# EasyEDA Pro project ProPrj_PomoDesk_V1.0.epro, schematic Schematic1

## Sheets
1 MAIN: Board Name: Board1; Create Date: 2025-03-01; Page Name: MAIN; Project Name: Pomodoro_desk; Schematic Name: Schematic1; Update Date: 2025-09-04; Company: EasyEDA.com; Page Size: A4; Version: V1.0
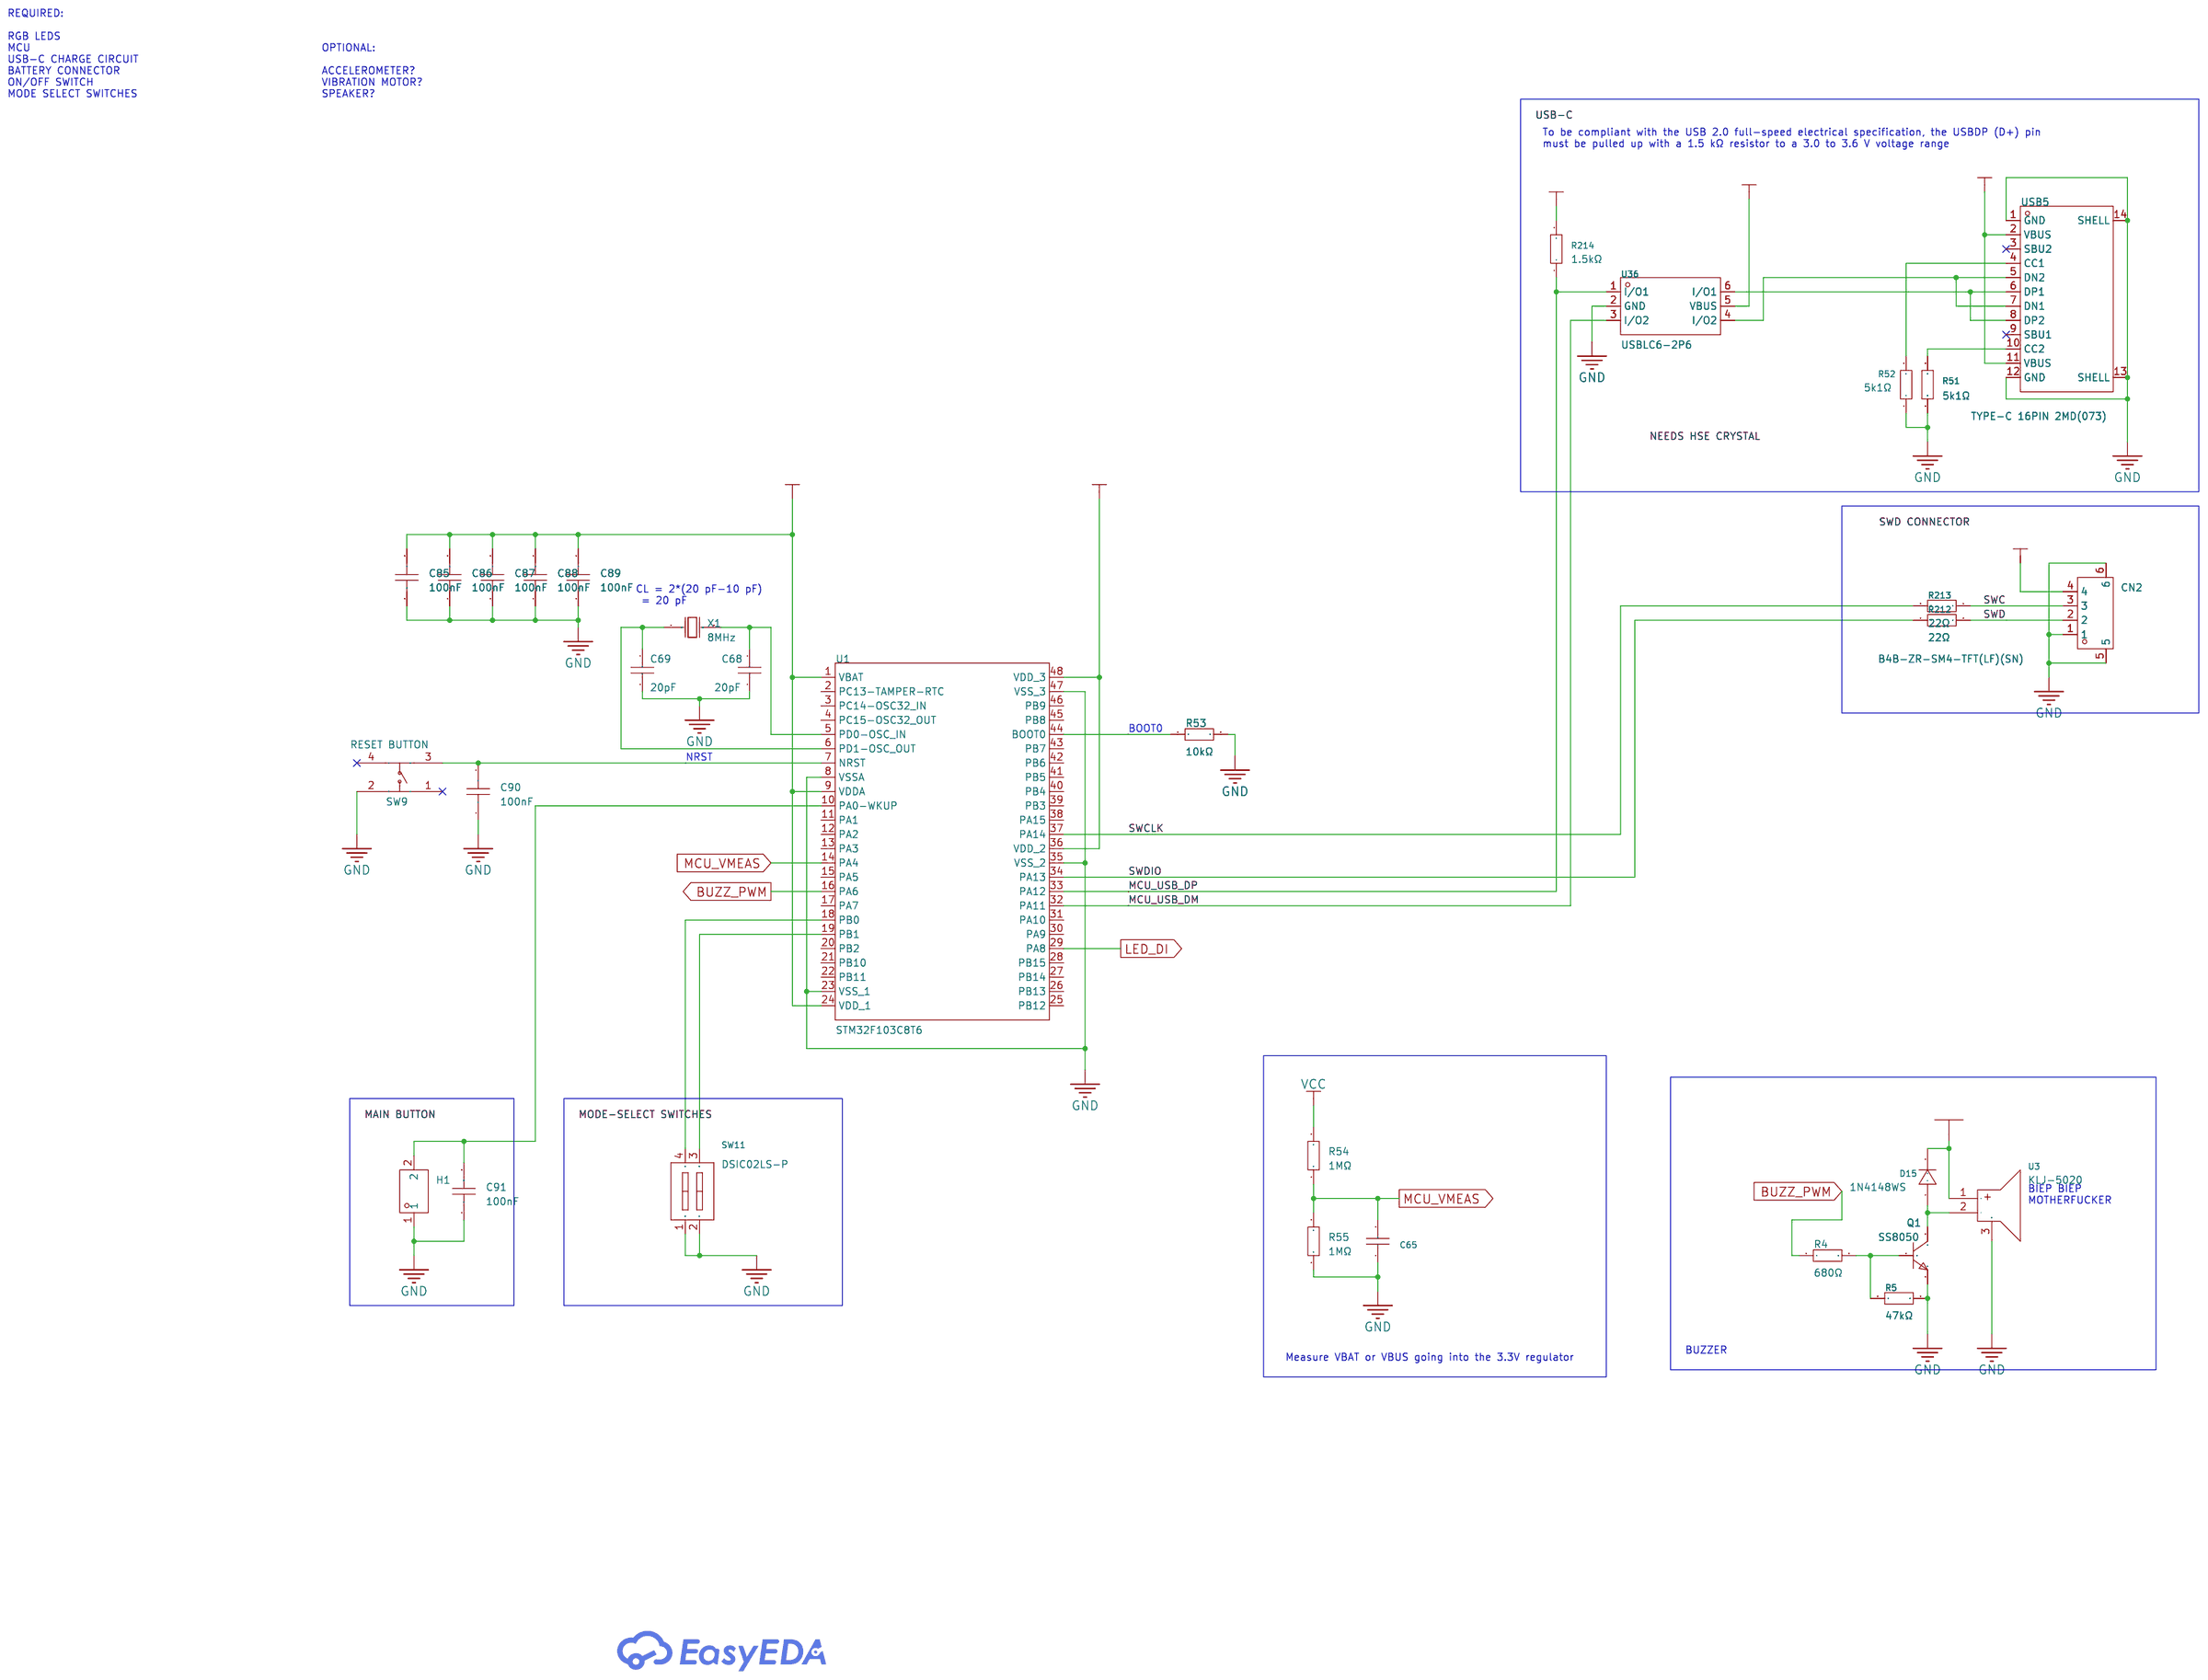
[diagram p0: MAIN]
2 LEDS: Create Date: 2025-08-28; Page Name: LEDS; Update Date: 2025-08-28
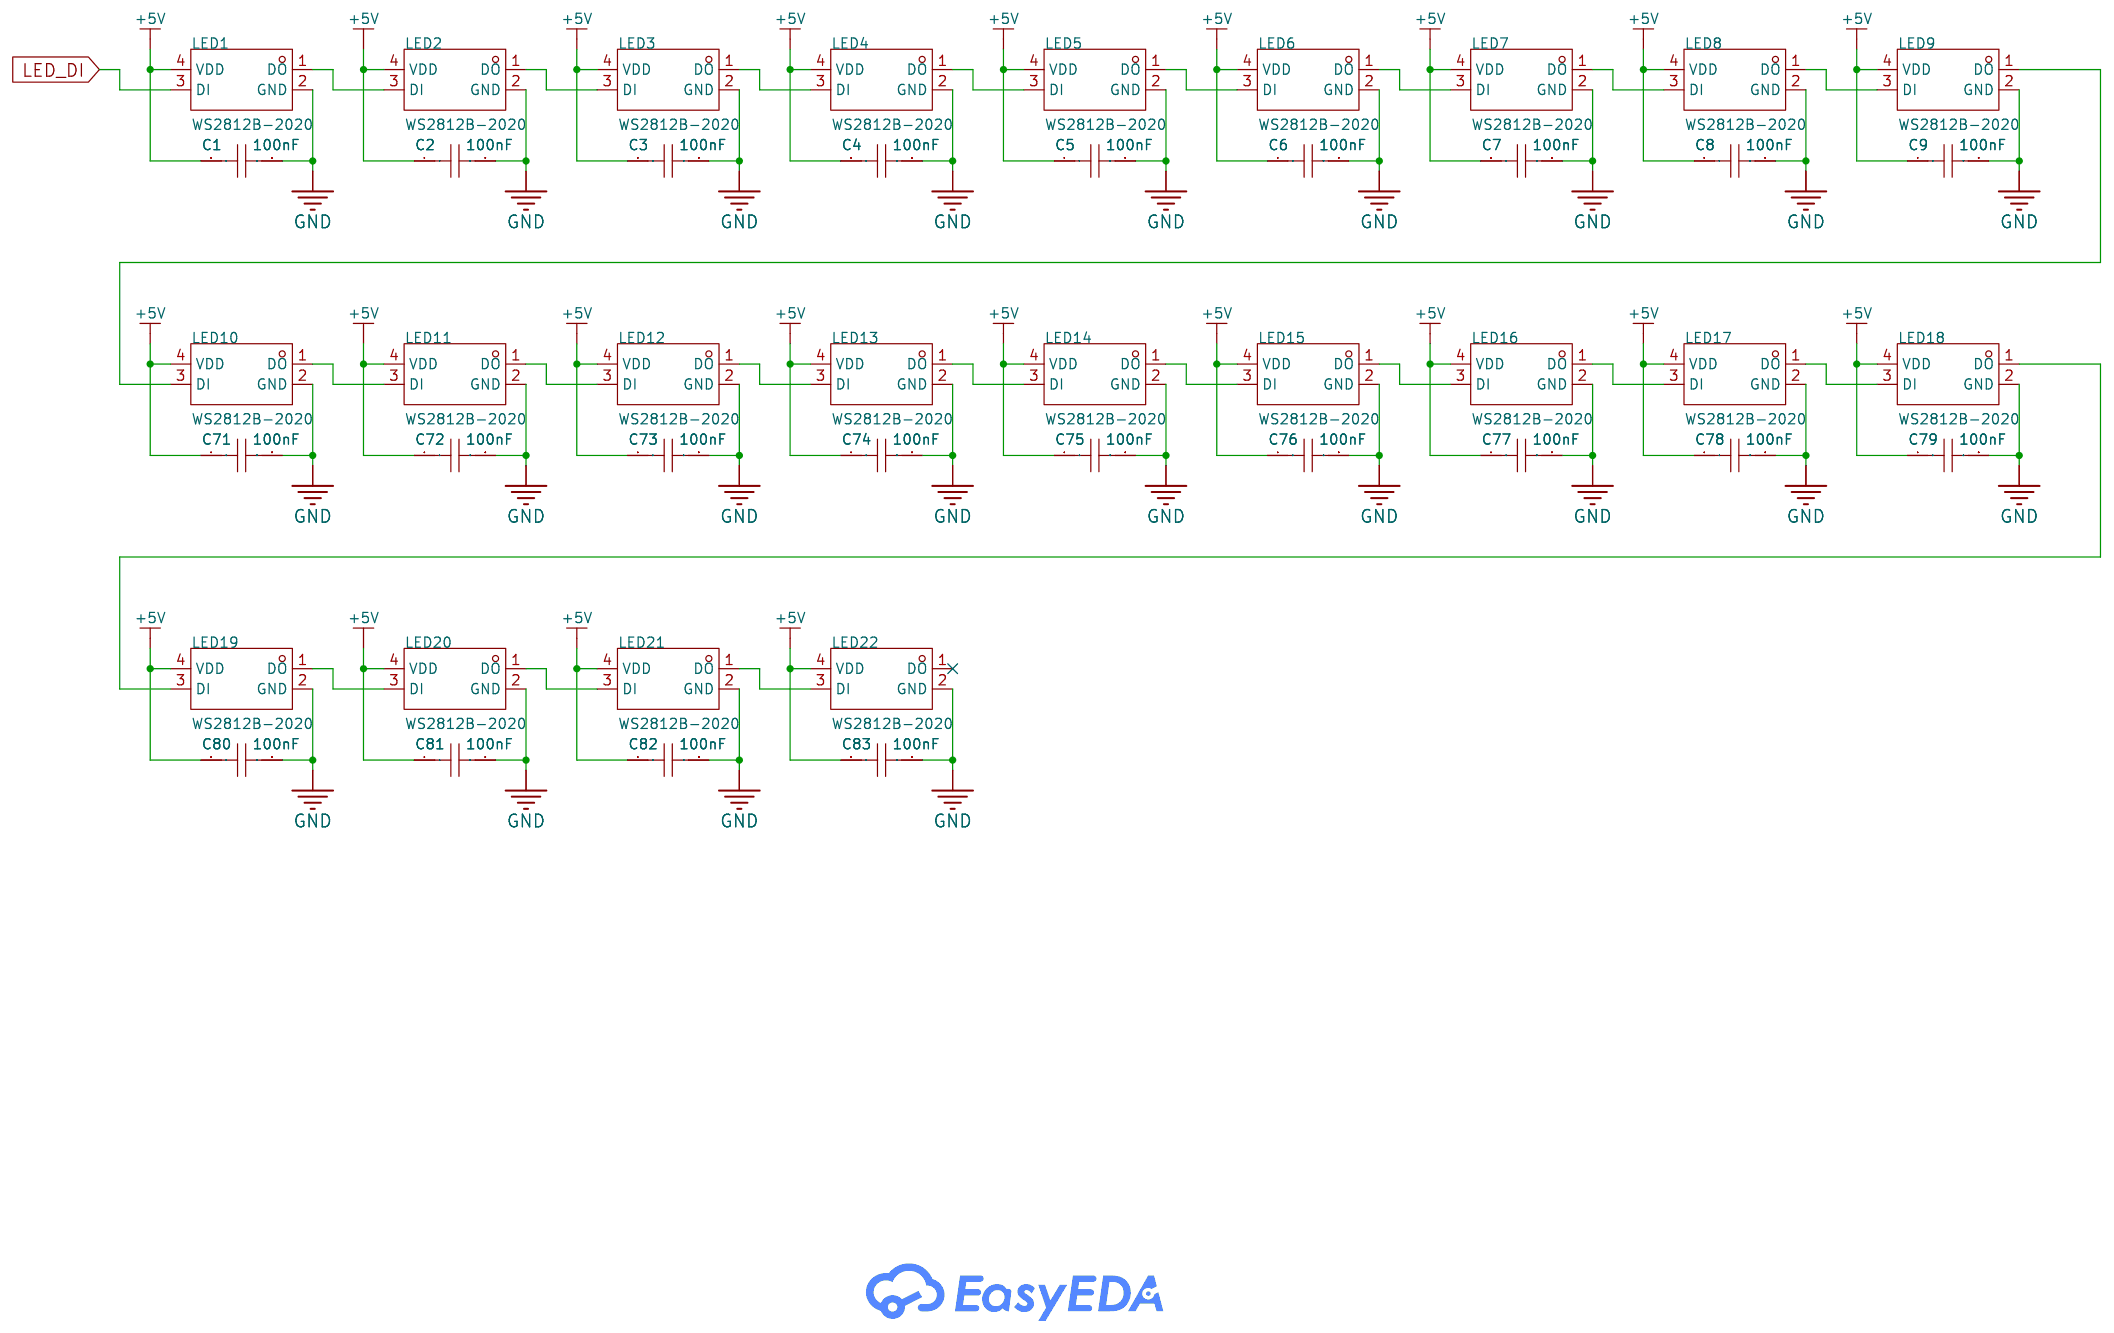
[diagram p1: LEDS]
3 POWER: Create Date: 2025-08-28; Page Name: POWER; Update Date: 2025-08-28
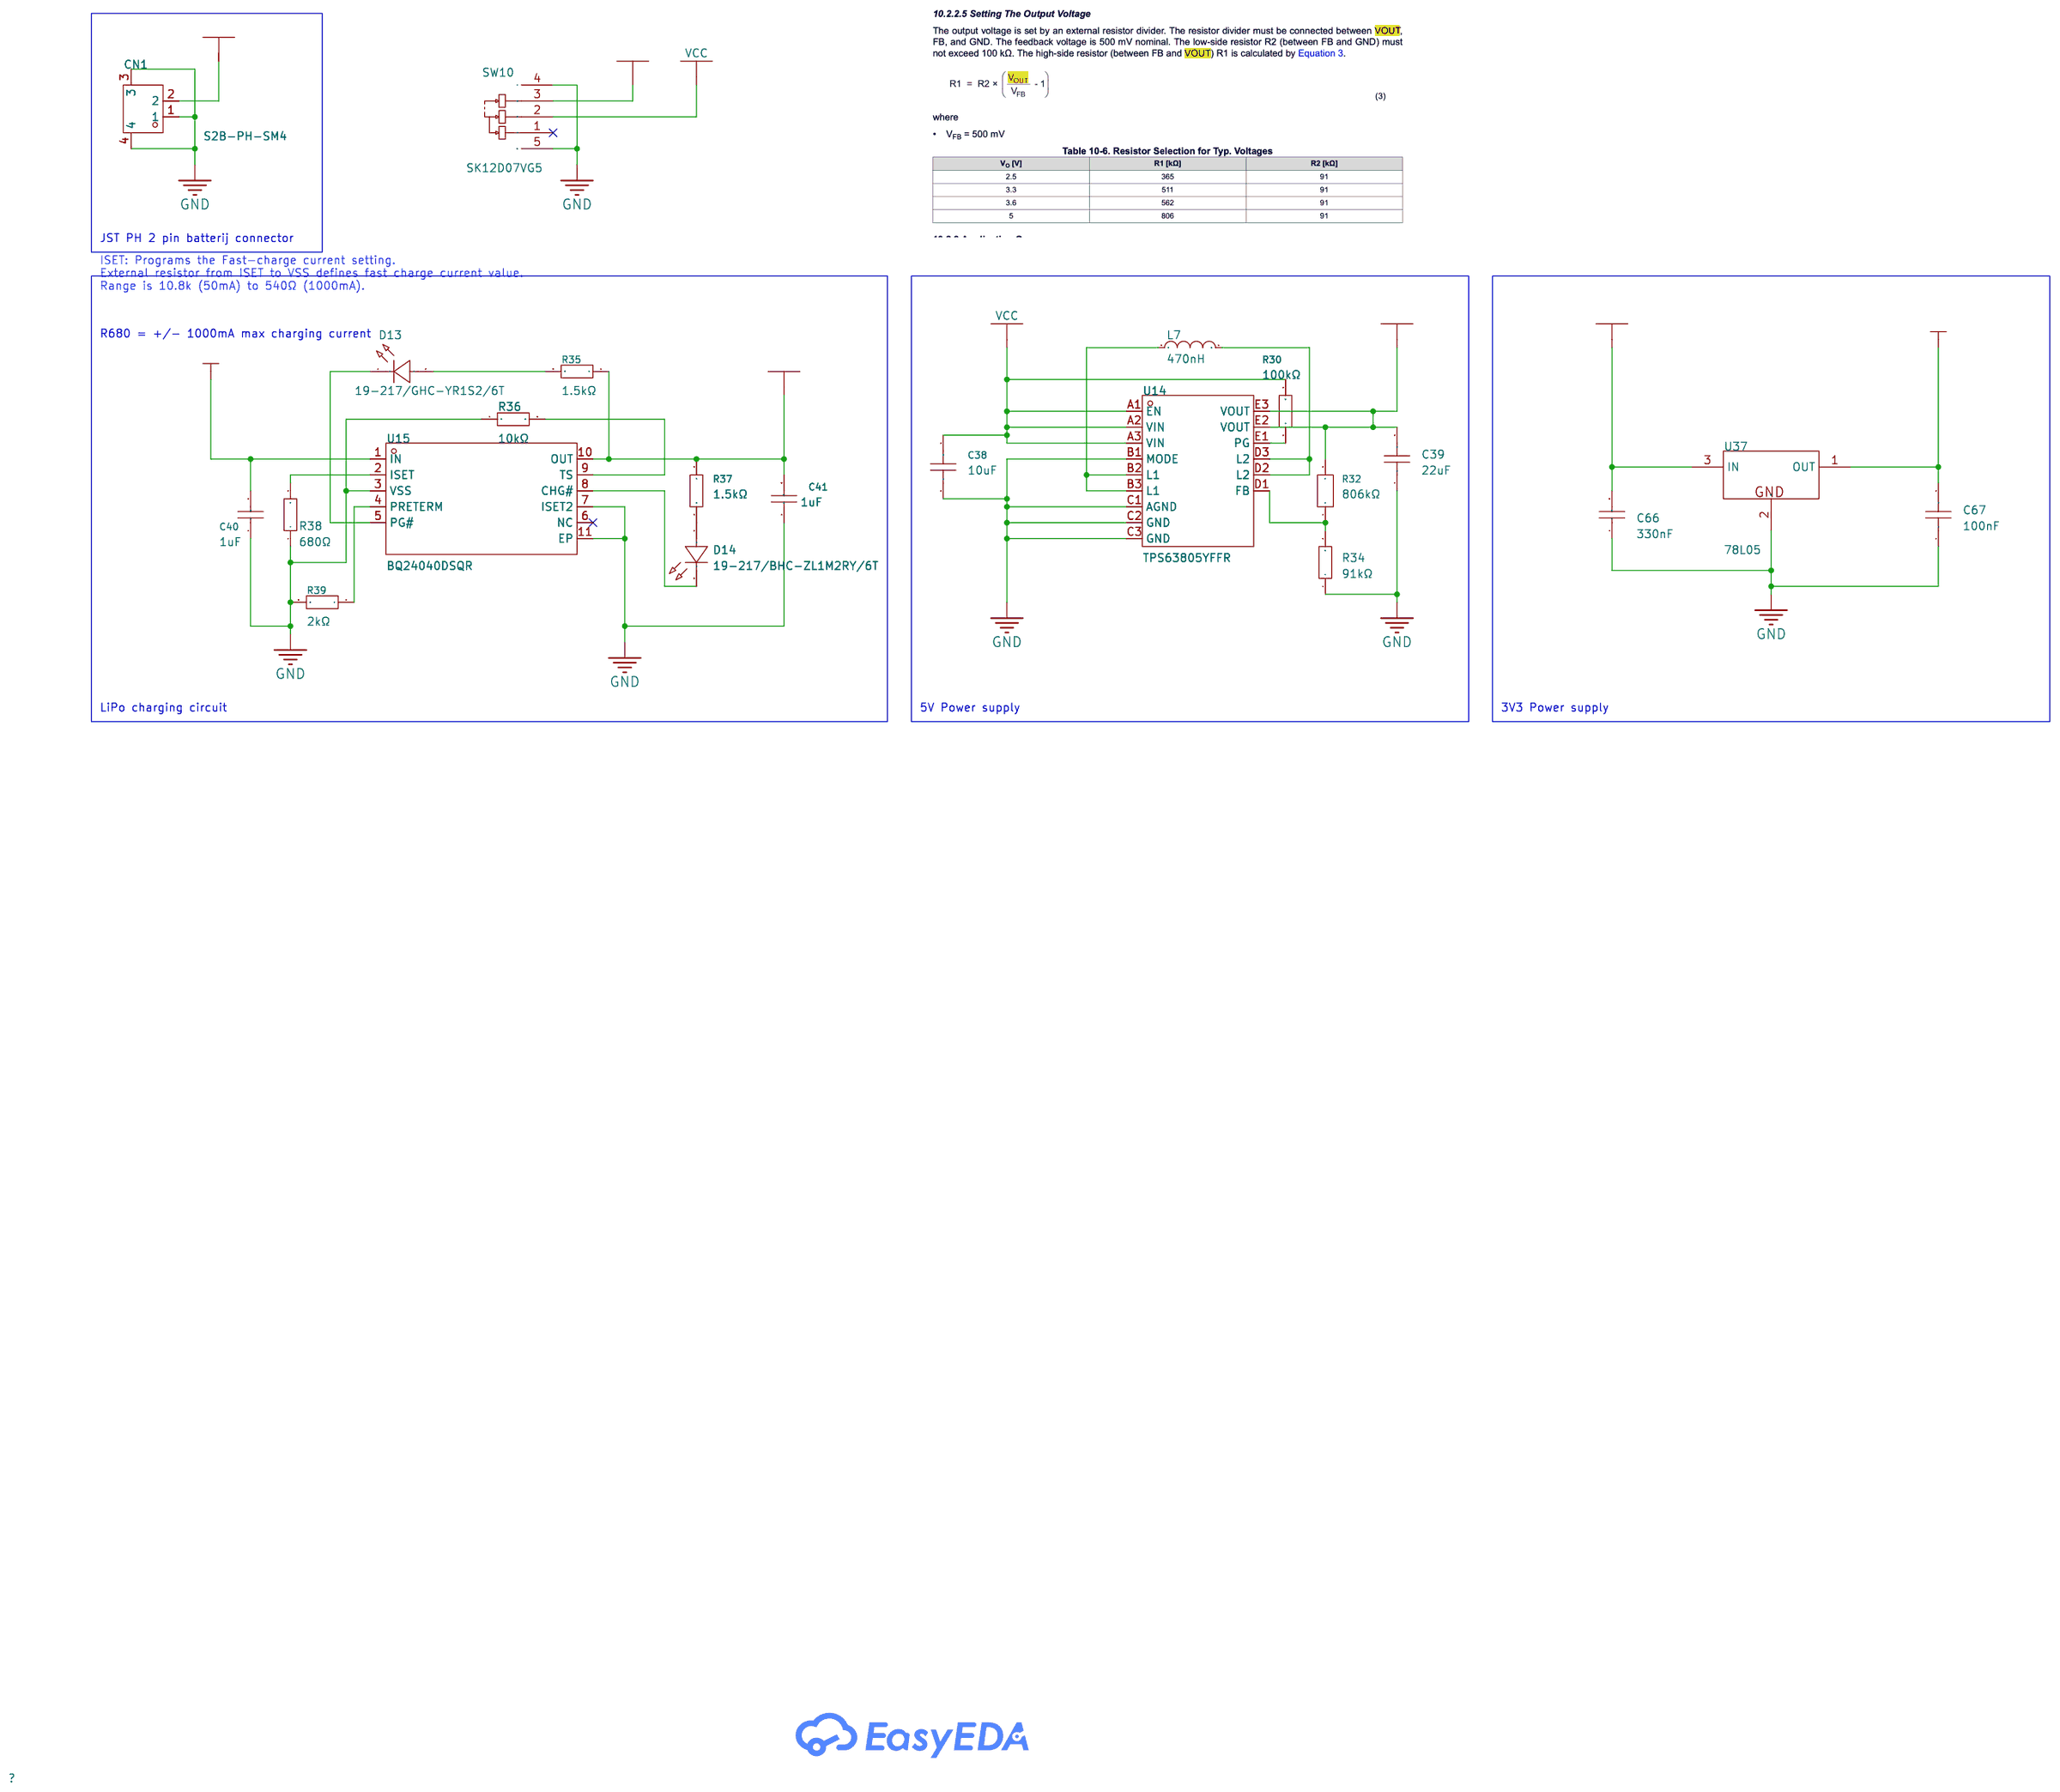
[diagram p2: POWER]

## Parts
sheet LEDS
C1  100nF  [C0402]
C2  100nF  [C0402]
C3  100nF  [C0402]
C4  100nF  [C0402]
C5  100nF  [C0402]
C6  100nF  [C0402]
C7  100nF  [C0402]
C8  100nF  [C0402]
C9  100nF  [C0402]
C71  100nF  [C0402]
C72  100nF  [C0402]
C73  100nF  [C0402]
C74  100nF  [C0402]
C75  100nF  [C0402]
C76  100nF  [C0402]
C77  100nF  [C0402]
C78  100nF  [C0402]
C79  100nF  [C0402]
C80  100nF  [C0402]
C81  100nF  [C0402]
C82  100nF  [C0402]
C83  100nF  [C0402]
LED1  WS2812B-2020  [LED-SMD_4P-L2.0-W2.0-TL_WS2812B-2020]
LED2  WS2812B-2020  [LED-SMD_4P-L2.0-W2.0-TL_WS2812B-2020]
LED3  WS2812B-2020  [LED-SMD_4P-L2.0-W2.0-TL_WS2812B-2020]
LED4  WS2812B-2020  [LED-SMD_4P-L2.0-W2.0-TL_WS2812B-2020]
LED5  WS2812B-2020  [LED-SMD_4P-L2.0-W2.0-TL_WS2812B-2020]
LED6  WS2812B-2020  [LED-SMD_4P-L2.0-W2.0-TL_WS2812B-2020]
LED7  WS2812B-2020  [LED-SMD_4P-L2.0-W2.0-TL_WS2812B-2020]
LED8  WS2812B-2020  [LED-SMD_4P-L2.0-W2.0-TL_WS2812B-2020]
LED9  WS2812B-2020  [LED-SMD_4P-L2.0-W2.0-TL_WS2812B-2020]
LED10  WS2812B-2020  [LED-SMD_4P-L2.0-W2.0-TL_WS2812B-2020]
LED11  WS2812B-2020  [LED-SMD_4P-L2.0-W2.0-TL_WS2812B-2020]
LED12  WS2812B-2020  [LED-SMD_4P-L2.0-W2.0-TL_WS2812B-2020]
LED13  WS2812B-2020  [LED-SMD_4P-L2.0-W2.0-TL_WS2812B-2020]
LED14  WS2812B-2020  [LED-SMD_4P-L2.0-W2.0-TL_WS2812B-2020]
LED15  WS2812B-2020  [LED-SMD_4P-L2.0-W2.0-TL_WS2812B-2020]
LED16  WS2812B-2020  [LED-SMD_4P-L2.0-W2.0-TL_WS2812B-2020]
LED17  WS2812B-2020  [LED-SMD_4P-L2.0-W2.0-TL_WS2812B-2020]
LED18  WS2812B-2020  [LED-SMD_4P-L2.0-W2.0-TL_WS2812B-2020]
LED19  WS2812B-2020  [LED-SMD_4P-L2.0-W2.0-TL_WS2812B-2020]
LED20  WS2812B-2020  [LED-SMD_4P-L2.0-W2.0-TL_WS2812B-2020]
LED21  WS2812B-2020  [LED-SMD_4P-L2.0-W2.0-TL_WS2812B-2020]
LED22  WS2812B-2020  [LED-SMD_4P-L2.0-W2.0-TL_WS2812B-2020]
sheet MAIN
C65  10nF  [C0402]
C68  20pF  [C0402]
C69  20pF  [C0402]
C85  100nF  [C0402]
C86  100nF  [C0402]
C87  100nF  [C0402]
C88  100nF  [C0402]
C89  100nF  [C0402]
C90  100nF  [C0402]
C91  100nF  [C0402]
CN2  B4B-ZR-SM4-TFT(LF)(SN)  [CONN-TH_B4B-ZR-SM4-TFT-LF-SN]
D15  1N4148WS  [SOD-323_L1.8-W1.3-LS2.5-RD]
H1  -  [HDR-TH_2P-P2.54-V-M-2]  (no BOM)
Q1  SS8050  [SOT-23-3_L2.9-W1.3-P1.90-LS2.4-BR]
R4  680Ω  [R0402]
R5  47kΩ  [R0402]
R51  5k1Ω  [R0402]
R52  5k1Ω  [R0402]
R53  10kΩ  [R0402]
R54  1MΩ  [R0402]
R55  1MΩ  [R0402]
R212  22Ω  [R0402]
R213  22Ω  [R0402]
R214  1.5kΩ  [R0402]
SW9  RESET BUTTON  [SW-SMD_4P-L4.2-W3.2-P2.15-LS4.5]
SW11  DSIC02LS-P  [SW-SMD_4P-L5.1-W6.1-P2.54-LS9.8]
U1  STM32F103C8T6  [LQFP-48_L7.0-W7.0-P0.50-LS9.0-BL]
U3  KLJ-5020  [BUZ-SMD_4P-L5.0-W5.0-P3.80-TL]
U36  USBLC6-2P6  [SOT-666-6_L1.6-W1.2-P0.50-LS1.6-BL]
USB5  TYPE-C 16PIN 2MD(073)  [USB-C-SMD_TYPE-C-6PIN-2MD-073]
X1  8MHz  [CRYSTAL-SMD_L5.0-W3.2]
sheet POWER
C38  10uF  [C0603]
C39  22uF  [C0603]
C40  1uF  [C0805]
C41  1uF  [C0805]
C66  330nF  [C0603]
C67  100nF  [C0402]
CN1  S2B-PH-SM4  [CONN-SMD_P2.00_S2B-PH-SM4-TB-LF-SN]
D13  19-217/GHC-YR1S2/6T  [LED0603-RD_GREEN]
D14  19-217/BHC-ZL1M2RY/6T  [LED0603-R-RD_BLUE-A]
L7  470nH  [L1008]
R30  100kΩ  [R0402]
R32  806kΩ  [R0402]
R34  91kΩ  [R0402]
R35  1.5kΩ  [R0402]
R36  10kΩ  [R0402]
R37  1.5kΩ  [R0402]
R38  680Ω  [R0402]
R39  2kΩ  [R0402]
SW10  SK12D07VG5  [SW-TH_SK12D07VG5-1]
U14  TPS63805YFFR  [DSBGA-15_L2.3-W1.3-R5-C3-P0.40-TL]
U15  BQ24040DSQR  [WSON-10_L2.0-W2.0-P0.40-BL-EP]
U37  78L05  [SOT-89-3_L4.5-W2.5-P1.50-LS4.2-BR]

## Library data of the parts
C1-C9 C67 C71-C83 C85-C91 = CL05B104KO5NNNC: Capacitance:100nF Tolerance:±10% Tolerance:±10% Voltage Rating:16V Temperature Coefficient:X7R; LCSC Part Name: 100nF ±10% 16V; Supplier Part: C1525; Manufacturer: SAMSUNG(三星); Supplier Footprint: 0402; JLCPCB Part Class: Basic Part; Datasheet: https://item.szlcsc.com/datasheet/CL05B104KO5NNNC/1877.html; Supplier: LCSC; Tolerance: ±10%; Voltage Rating: 16V; Temperature Coefficient: X7R
LED1-LED22 = WS2812B-2020: Wavelength:515.6nm；622.5nm；470.4nm Luminous Intensity:200mcd；160mcd；520mcd Fixed-Frequency Pwm Mode:- Data Transmission Rate:100KB/S Voltage - Supply:5V Voltage - Supply:5V Quiescent Current:- Lens Color:- ESD Withstand Voltage:- Installation method:op Vi; LCSC Part Name: RGB三色; Supplier Part: C965555; Manufacturer: worldsemi; Supplier Footprint: SMD,2.2x2mm; JLCPCB Part Class: Extended Part; Datasheet: https://item.szlcsc.com/datasheet/WS2812B-2020/1051115.html; Supplier: LCSC; Wavelength: 515.6nm；622.5nm；470.4nm; Luminous Intensity: 200mcd；160mcd；520mcd; Data Transmission Rate: 100KB/S; Voltage - Supply: 5V; Installation method: op View Mount
C65 = CL05B103KB5NNNC: Capacitance: Tolerance:±10% Tolerance:±10% Voltage Rated: Temperature Coefficient:; LCSC Part Name: 10nF ±10% 50V; Supplier Part: C15195; Manufacturer: SAMSUNG(三星); Supplier Footprint: 0402; JLCPCB Part Class: Basic Part; Datasheet: https://atta.szlcsc.com/upload/public/pdf/source/20160218/1457707763339.pdf; Supplier: LCSC; Tolerance: ±10%
C68 C69 = 0402CG200J500NT: Capacitance:20pF Tolerance:±5% Tolerance:±5% Voltage Rating:50V Temperature Coefficient:C0G; LCSC Part Name: 20pF ±5% 50V; Supplier Part: C1554; Manufacturer: FH(风华); Supplier Footprint: 0402; JLCPCB Part Class: Basic Part; Datasheet: https://item.szlcsc.com/datasheet/0402CG200J500NT/1906.html; Supplier: LCSC; Tolerance: ±5%; Voltage Rating: 50V; Temperature Coefficient: C0G
CN2 = B4B-ZR-SM4-TFT(LF)(SN): Pins Structure:1x4P Pitch:1.5mm Mounting Type:Surface Mount,Vertical Reference Series:ZH Number of Pins:4P Number of Rows:1 Number of PINs Per Row:4 Row Spacing:- Current Rating:1A Contact Material:Brass Contact Plating:Tin Operating Temperature:-25℃~+85℃; LCSC Part Name: 1x4P 间距:1.5mm 立贴 系列:ZH; Supplier Part: C495544; Manufacturer: JST; Supplier Footprint: SMD,P=1.5mm; JLCPCB Part Class: Extended Part; Datasheet: https://item.szlcsc.com/datasheet/B4B-ZR-SM4-TFT(LF)(SN)/506553.html; Supplier: LCSC; Pins Structure: 1x4P; Pitch: 1.5mm; Mounting Type: Surface Mount,Vertical; Reference Series: ZH; Number of Pins: 4P; Number of Rows: 1; Number of PINs Per Row: 4; Current Rating: 1A; Contact Material: Brass; Contact Plating: Tin; Operating Temperature: -25℃~+85℃; Voltage Rating: 50V; Plastic Material: PA6T; Flame Retardant Rating: UL94V-0; Supplementary Features: Auxiliary Solder Pin; Color: White; Z-Height of the Board: 5mm; X-Length of Bottom Edge on Board (Spacing Line): 9mm; Y-Width of Bottom Edge on Board: 5.2mm
D15 = 1N4148WS_C2128: Diode Configuration: Forward Voltage (Vf@If):1.25V@150mA Reverse Voltage (Vr): Average Rectified Current (Io): Power Dissipation: Reverse Leakage Current:1uA@75V Reverse Recovery Time (trr): Operating Temperature:- Operating Temperature:-; LCSC Part Name: 电压:100V 电流:150mA; Supplier Part: C2128; Manufacturer: CJ(江苏长电/长晶); Supplier Footprint: SOD-323; JLCPCB Part Class: Basic Part; Datasheet: https://atta.szlcsc.com/upload/public/pdf/source/20140809/1457707208178.pdf; Supplier: LCSC; Forward Voltage (Vf@If): 1.25V@150mA; Reverse Leakage Current: 1uA@75V
H1 = HDR-M_2.54_2x1: Supplier Footprint: Through
Q1 = SS8050_C2150: Transistor Type: Collector Current (Ic): Collector-Emitter Breakdown Voltage (Vceo): Power Dissipation (Pd): DC Current Gain (hFE@Ic,Vce):200@100mA,1V DC Current Gain (hFE@Ic,Vce):200@100mA,1V Transition Frequency (fT):100MHz Collector Cut-Off Current (Ic; LCSC Part Name: SS8050(RANGE:200-350) hfe=200~350; Supplier Part: C2150; Manufacturer: CJ(江苏长电/长晶); Supplier Footprint: SOT-23; JLCPCB Part Class: Basic Part; Datasheet: https://atta.szlcsc.com/upload/public/pdf/source/20230322/AEE86F4B043774EFF80CAEA14A37D9E9.pdf; Supplier: LCSC; DC Current Gain (hFE@Ic,Vce): 200@100mA,1V; Transition Frequency (fT): 100MHz; Collector Cut-Off Current (Icbo): 100nA; Collector-Emitter Saturation Voltage (VCE(sat)@Ic,Ib): 500mV@800mA,80mA
R4 R38 = 0402WGF6800TCE: Type:Thick Film Resistors Resistance: Tolerance:±1% Tolerance:±1% Power(Watts): Overload Voltage (Max): Temperature Coefficient:±100ppm/℃ Temperature Coefficient:±100ppm/℃ Operating Temperature Range:-55℃~+155℃ Operating Temperature Range:-55℃~+155℃; LCSC Part Name: 680Ω ±1% 62.5mW 厚膜电阻; Supplier Part: C25130; Manufacturer: UNI-ROYAL(厚声); Supplier Footprint: 0402; JLCPCB Part Class: Extended Part; Datasheet: https://atta.szlcsc.com/upload/public/pdf/source/20200306/C422600_1E6D84923E4A46A82E41ADD87F860B5C.pdf; Supplier: LCSC; Type: Thick Film Resistors; Tolerance: ±1%; Temperature Coefficient: ±100ppm/℃; Operating Temperature Range: -55℃~+155℃
R5 = 0402WGF4702TCE: Type:Thick Film Resistors Resistance:47kΩ Tolerance:±1% Tolerance:±1% Power(Watts): Overload Voltage (Max): Temperature Coefficient:±100ppm/℃ Temperature Coefficient:±100ppm/℃ Operating Temperature Range:-55℃~+155℃ Operating Temperature Range:-55℃~+155℃; LCSC Part Name: 47kΩ ±1% 62.5mW 厚膜电阻; Supplier Part: C25792; Manufacturer: UNI-ROYAL(厚声); Supplier Footprint: 0402; JLCPCB Part Class: Basic Part; Datasheet: https://atta.szlcsc.com/upload/public/pdf/source/20200306/C422600_1E6D84923E4A46A82E41ADD87F860B5C.pdf; Supplier: LCSC; Type: Thick Film Resistors; Tolerance: ±1%; Temperature Coefficient: ±100ppm/℃; Operating Temperature Range: -55℃~+155℃
R51 R52 = 0402WGF5101TCE: Type:Thick Film Resistors Resistance:5.1kΩ Tolerance:±1% Tolerance:±1% Power(Watts): Overload Voltage (Max): Temperature Coefficient:±100ppm/℃ Temperature Coefficient:±100ppm/℃ Operating Temperature Range:-55℃~+155℃ Operating Temperature Range:-55℃~+155℃; LCSC Part Name: 5.1kΩ ±1% 62.5mW 厚膜电阻; Supplier Part: C25905; Manufacturer: UNI-ROYAL(厚声); Supplier Footprint: 0402; JLCPCB Part Class: Basic Part; Datasheet: https://atta.szlcsc.com/upload/public/pdf/source/20200306/C422600_1E6D84923E4A46A82E41ADD87F860B5C.pdf; Supplier: LCSC; Type: Thick Film Resistors; Tolerance: ±1%; Temperature Coefficient: ±100ppm/℃; Operating Temperature Range: -55℃~+155℃
R36 R53 = 0402WGF1002TCE: Type:Thick Film Resistors Resistance:10kΩ Tolerance:±1% Tolerance:±1% Power(Watts): Overload Voltage (Max): Temperature Coefficient:±100ppm/℃ Temperature Coefficient:±100ppm/℃ Operating Temperature Range:-55℃~+155℃ Operating Temperature Range:-55℃~+155℃; LCSC Part Name: 10kΩ ±1% 62.5mW 厚膜电阻; Supplier Part: C25744; Manufacturer: UNI-ROYAL(厚声); Supplier Footprint: 0402; JLCPCB Part Class: Basic Part; Datasheet: https://atta.szlcsc.com/upload/public/pdf/source/20200306/C422600_1E6D84923E4A46A82E41ADD87F860B5C.pdf; Supplier: LCSC; Type: Thick Film Resistors; Tolerance: ±1%; Temperature Coefficient: ±100ppm/℃; Operating Temperature Range: -55℃~+155℃
R54 R55 = 0402WGF1004TCE: Type:Thick Film Resistors Resistance:1MΩ Tolerance:±1% Tolerance:±1% Power(Watts): Overload Voltage (Max): Temperature Coefficient:±100ppm/℃ Temperature Coefficient:±100ppm/℃ Operating Temperature Range:-55℃~+155℃ Operating Temperature Range:-55℃~+155℃; LCSC Part Name: 1MΩ ±1% 62.5mW 厚膜电阻; Supplier Part: C26083; Manufacturer: UNI-ROYAL(厚声); Supplier Footprint: 0402; JLCPCB Part Class: Basic Part; Datasheet: https://atta.szlcsc.com/upload/public/pdf/source/20200306/C422600_1E6D84923E4A46A82E41ADD87F860B5C.pdf; Supplier: LCSC; Type: Thick Film Resistors; Tolerance: ±1%; Temperature Coefficient: ±100ppm/℃; Operating Temperature Range: -55℃~+155℃
R212 R213 = 0402WGF220JTCE: Type:Thick Film Resistors Resistance:22Ω Tolerance:±1% Tolerance:±1% Power(Watts): Overload Voltage (Max): Temperature Coefficient:±100ppm/℃ Temperature Coefficient:±100ppm/℃ Operating Temperature Range:-55℃~+155℃ Operating Temperature Range:-55℃~+155℃; LCSC Part Name: 22Ω ±1% 62.5mW 厚膜电阻; Supplier Part: C25092; Manufacturer: UNI-ROYAL(厚声); Supplier Footprint: 0402; JLCPCB Part Class: Basic Part; Datasheet: https://atta.szlcsc.com/upload/public/pdf/source/20200306/C422600_1E6D84923E4A46A82E41ADD87F860B5C.pdf; Supplier: LCSC; Type: Thick Film Resistors; Tolerance: ±1%; Temperature Coefficient: ±100ppm/℃; Operating Temperature Range: -55℃~+155℃
R35 R37 R214 = 0402WGF1501TCE: Type:Thick Film Resistors Resistance:1.5kΩ Tolerance:±1% Tolerance:±1% Power(Watts): Overload Voltage (Max): Temperature Coefficient:±100ppm/℃ Temperature Coefficient:±100ppm/℃ Operating Temperature Range:-55℃~+155℃ Operating Temperature Range:-55℃~+155℃; LCSC Part Name: 1.5kΩ ±1% 62.5mW 厚膜电阻; Supplier Part: C25867; Manufacturer: UNI-ROYAL(厚声); Supplier Footprint: 0402; JLCPCB Part Class: Basic Part; Datasheet: https://atta.szlcsc.com/upload/public/pdf/source/20200306/C422600_1E6D84923E4A46A82E41ADD87F860B5C.pdf; Supplier: LCSC; Type: Thick Film Resistors; Tolerance: ±1%; Temperature Coefficient: ±100ppm/℃; Operating Temperature Range: -55℃~+155℃
SW9 = GT-TC048D-H025-L1: Circuit:SPST Actuator Style:Oval button Operating Force:400gf Mounting Style:Brick nogging Switch Length:4.2mm Switch Width:3.2mm Switch Height:2.5mm Strike Gundam:不带 Contact Current:50mA Voltage Rating (DC):12V Insulation Resistance:100MΩ Actuator/Cap Co; LCSC Part Name: 4.2*3.2*2.5mm 立贴 轻触开关; Supplier Part: C843674; Manufacturer: G-Switch(品赞); Supplier Footprint: SMD; JLCPCB Part Class: Extended Part; Datasheet: https://atta.szlcsc.com/upload/public/pdf/source/20201110/C843674_6F8C4412097F3852FA32BC425FAAA2F5.pdf; Supplier: LCSC; Circuit: SPST; Actuator Style: Oval button; Operating Force: 400gf; Mounting Style: Brick nogging; Switch Length: 4.2mm; Switch Width: 3.2mm; Switch Height: 2.5mm; Strike Gundam: 不带; Contact Current: 50mA; Voltage Rating (DC): 12V; Insulation Resistance: 100MΩ; Actuator/Cap Color: Black; With Lamp: No; Pin Style: J pin; Mechanical Life: 10万次; Operating Temperature: -30℃~+85℃
SW11 = DSIC02LS-P_C489174: Type:平拨,凸起式 Circuit:SPST Number of Positions:2Bit Pin Style:Gull Wing Lead Pitch:2.54mm Current Rating:25mA Voltage Rating:24V Operating Temperature:-20℃~+70℃ Operating Temperature:-20℃~+70℃ Operating Life:3千次 Color:Black; LCSC Part Name: 间距2.54mm 平拨,凸起式 2位拨码开关; Supplier Part: C489174; Manufacturer: XKB Connectivity(中国星坤); Supplier Footprint: SMD-4P,5.1x6.1mm; JLCPCB Part Class: Extended Part; Datasheet: https://atta.szlcsc.com/upload/public/pdf/source/20200227/C424380_7B5FE7C891E0521A8B96890FFC9096F0.pdf; Supplier: LCSC; Type: 平拨,凸起式; Circuit: SPST; Number of Positions: 2Bit; Pin Style: Gull Wing; Lead Pitch: 2.54mm; Current Rating: 25mA; Voltage Rating: 24V; Operating Temperature: -20℃~+70℃; Operating Life: 3千次; Color: Black
U1 = STM32F103C8T6: CPU Core:ARM-M3 CPU Maximum Speed:72MHz Program Storage Size:64KB Program Memory Type:FLASH Number of I/O:37 ADC (Bit):12bit Voltage - Supply:2V~3.6V Voltage - Supply:2V~3.6V Applications:-; LCSC Part Name: 主流增强型ARM Cortex-M3 MCU，具有64 KB Flash、72 MHz CPU、电机控制、USB和CAN; Supplier Part: C8734; Manufacturer: ST(意法半导体); Supplier Footprint: LQFP-48(7x7); JLCPCB Part Class: Extended Part; Datasheet: https://item.szlcsc.com/datasheet/STM32F103C8T6/9243.html; Supplier: LCSC; CPU Core: ARM-M3; CPU Maximum Speed: 72MHz; Program Storage Size: 64KB; Program Memory Type: FLASH; Number of I/O: 37; ADC (Bit): 12bit; Voltage - Supply: 2V~3.6V
U3 = KLJ-5020: LCSC Part Name: 贴片蜂鸣器; Supplier Part: C556937; Manufacturer: KELIKING(凯丽金); Supplier Footprint: SMD,5x5mm; JLCPCB Part Class: Extended Part; Datasheet: https://atta.szlcsc.com/upload/public/pdf/source/20200519/C556937_434224E60D77FB2EA05BB02010B3CD4E.pdf; Supplier: LCSC
U36 = USBLC6-2P6: Type:ESD; LCSC Part Name: MSL=3; Supplier Part: C2827693; Manufacturer: TECH PUBLIC(台舟); Supplier Footprint: SOT-666-6; JLCPCB Part Class: Extended Part; Datasheet: https://atta.szlcsc.com/upload/public/pdf/source/20210810/36353A9194EA9F4E33F8AE18BE051AEA.pdf; Supplier: LCSC; Type: ESD
USB5 = TYPE-C 16PIN 2MD(073): Connector Type:Type-C Protocol Standard:- Gender:Female Mounting Type:Surface Mount, Right Angle Number of Contacts:16P Number of Ports:1 Current Rating-Power:3A Voltage Rating:5V Connect-Disconnect Life:5,000 Cycles Supplementary Features:- Center Height; LCSC Part Name: Type-C 母 卧贴; Supplier Part: C2765186; Manufacturer: SHOU HAN(首韩); Supplier Footprint: SMD; JLCPCB Part Class: Extended Part; Datasheet: https://item.szlcsc.com/datasheet/TYPE-C%252016PIN%25202MD(073)/2901843.html; Supplier: LCSC; Connector Type: Type-C; Gender: Female; Mounting Type: Surface Mount, Right Angle; Number of Contacts: 16P; Number of Ports: 1; Current Rating-Power: 3A; Voltage Rating: 5V; Connect-Disconnect Life: 5,000 Cycles; Detection color: Black; Operating Temperature: -25℃~+85℃
X1 = X50328MSB2GI: Type:Crystal Oscillator Frequency:8MHz Normal temperature Frequency Tolerance:±10ppm Normal temperature Frequency Tolerance:±10ppm Load Capacitance:20pF Frequency Stability:±20ppm Frequency Stability:±20ppm Operating Temperature:-40℃~+85℃ Operating Temper; LCSC Part Name: YSX530GA 8MHZ 2P 5032 20PF ±10PPM -40~85℃ (±20PPM); Supplier Part: C115962; Manufacturer: YXC(扬兴晶振); Supplier Footprint: SMD5032-2P; JLCPCB Part Class: Basic Part; Datasheet: https://item.szlcsc.com/datasheet/X50328MSB2GI/117214.html; Supplier: LCSC; Type: Crystal Oscillator; Normal temperature Frequency Tolerance: ±10ppm; Load Capacitance: 20pF; Frequency Stability: ±20ppm; Operating Temperature: -40℃~+85℃
C38 = CL10A106KP8NNNC: Capacitance: Tolerance:±10% Tolerance:±10% Voltage Rated: Temperature Coefficient:; LCSC Part Name: 10uF ±10% 10V; Supplier Part: C19702; Manufacturer: SAMSUNG(三星); Supplier Footprint: 0603; JLCPCB Part Class: Basic Part; Datasheet: https://atta.szlcsc.com/upload/public/pdf/source/20160218/1457707763339.pdf; Supplier: LCSC; Tolerance: ±10%
C39 = CL10A226MQ8NRNC: Capacitance: Tolerance:±20% Tolerance:±20% Voltage Rated: Temperature Coefficient:; LCSC Part Name: 22uF ±20% 6.3V; Supplier Part: C59461; Manufacturer: SAMSUNG(三星); Supplier Footprint: 0603; JLCPCB Part Class: Basic Part; Datasheet: https://atta.szlcsc.com/upload/public/pdf/source/20160218/1457707763339.pdf; Supplier: LCSC; Tolerance: ±20%
C40 C41 = CL21B105KBFNNNE: Capacitance: Tolerance:±10% Tolerance:±10% Voltage Rated: Temperature Coefficient:; LCSC Part Name: 1uF ±10% 50V; Supplier Part: C28323; Manufacturer: SAMSUNG(三星); Supplier Footprint: 0805; JLCPCB Part Class: Basic Part; Datasheet: https://atta.szlcsc.com/upload/public/pdf/source/20160218/1457707763339.pdf; Supplier: LCSC; Tolerance: ±10%
C66 = 0603B334K250NT: Capacitance:330nF Tolerance:±10% Tolerance:±10% Voltage Rating:25V Temperature Coefficient:X7R; LCSC Part Name: 330nF ±10% 25V; Supplier Part: C1615; Manufacturer: FH(风华); Supplier Footprint: 0603; JLCPCB Part Class: Extended Part; Datasheet: https://item.szlcsc.com/datasheet/0603B334K250NT/1967.html; Supplier: LCSC; Tolerance: ±10%; Voltage Rating: 25V; Temperature Coefficient: X7R
CN1 = S2B-PH-SM4-TB(LF)(SN): Pins Structure:1x2P Pitch:2mm Mounting Style:卧贴 Reference Series:PH Number of Pins:2P Number of Rows:1 Number of PINs Per Row:2 Row Spacing:- Current Rating (Max):2A Contact Material:Copper Alloy Contact Plating:Tin Operating Temperature Range:-25℃~+85℃ O; LCSC Part Name: 1x2P 间距:2mm 卧贴 系列:PH; Supplier Part: C295747; Manufacturer: JST; Supplier Footprint: SMD,P=2mm,卧贴; JLCPCB Part Class: Extended Part; Datasheet: https://atta.szlcsc.com/upload/public/pdf/source/20210203/C295747_344B2E64535E381E727D98C302AB61C7.pdf; Supplier: LCSC; Pins Structure: 1x2P; Pitch: 2mm; Mounting Style: 卧贴; Reference Series: PH; Number of Pins: 2P; Number of Rows: 1; Number of PINs Per Row: 2; Current Rating (Max): 2A; Contact Material: Copper Alloy; Contact Plating: Tin; Operating Temperature Range: -25℃~+85℃; Rated Voltage (Max): 100V; Plastic Material: PA; Flame Retardant Rating: UL94V-0; Z-Height of the Board: 5.5mm; X-Length of Bottom Edge on Board (Spacing Line): 7.9mm; Y-Width of Bottom Edge on Board: 8.6mm
D13 = 19-217/GHC-YR1S2/6T: LCSC Part Name: 翠绿; Supplier Part: C2986059; Manufacturer: EVERLIGHT(亿光); Supplier Footprint: 0603; JLCPCB Part Class: Extended Part; Datasheet: https://atta.szlcsc.com/upload/public/pdf/source/20220705/5270194960AA522E2931401D212035CB.pdf; Supplier: LCSC
D14 = 19-217/BHC-ZL1M2RY/6T: Supplier Part: C2986058; Manufacturer: EVERLIGHT(亿光); Supplier Footprint: 0603; JLCPCB Part Class: Extended Part; Datasheet: https://atta.szlcsc.com/upload/public/pdf/source/20220517/A8D2ADFAD5C1E5765B06C80C177CA8BD.pdf; Supplier: LCSC
L7 = 1239AS-H-R47M=P2: Inductance: Tolerance:±20% Tolerance:±20% Rated Current: Saturation Current (Isat):3.8A DC Resistance (DCR): Ratings:-; LCSC Part Name: 470nH ±20% 3.8A; Supplier Part: C576393; Manufacturer: muRata(村田); Supplier Footprint: 1008; JLCPCB Part Class: Extended Part; Datasheet: https://atta.szlcsc.com/upload/public/pdf/source/20230811/CEB0FF5CE4B284DC84AD7783B77C7832.pdf; Supplier: LCSC; Tolerance: ±20%; Saturation Current (Isat): 3.8A
R30 = 0402WGF1003TCE: Type:Thick Film Resistors Resistance:100kΩ Tolerance:±1% Tolerance:±1% Power(Watts): Overload Voltage (Max): Temperature Coefficient:±100ppm/℃ Temperature Coefficient:±100ppm/℃ Operating Temperature Range:-55℃~+155℃ Operating Temperature Range:-55℃~+155℃; LCSC Part Name: 100kΩ ±1% 62.5mW 厚膜电阻; Supplier Part: C25741; Manufacturer: UNI-ROYAL(厚声); Supplier Footprint: 0402; JLCPCB Part Class: Basic Part; Datasheet: https://atta.szlcsc.com/upload/public/pdf/source/20200306/C422600_1E6D84923E4A46A82E41ADD87F860B5C.pdf; Supplier: LCSC; Type: Thick Film Resistors; Tolerance: ±1%; Temperature Coefficient: ±100ppm/℃; Operating Temperature Range: -55℃~+155℃
R32 = 0402WGF8063TCE: Type:Thick Film Resistors Resistance:806kΩ Tolerance:±1% Tolerance:±1% Power(Watts): Overload Voltage (Max): Temperature Coefficient:±100ppm/℃ Temperature Coefficient:±100ppm/℃ Operating Temperature Range:-55℃~+155℃ Operating Temperature Range:-55℃~+155℃; LCSC Part Name: 806kΩ ±1% 62.5mW 厚膜电阻; Supplier Part: C29263; Manufacturer: UNI-ROYAL(厚声); Supplier Footprint: 0402; JLCPCB Part Class: Extended Part; Datasheet: https://atta.szlcsc.com/upload/public/pdf/source/20200306/C422600_1E6D84923E4A46A82E41ADD87F860B5C.pdf; Supplier: LCSC; Type: Thick Film Resistors; Tolerance: ±1%; Temperature Coefficient: ±100ppm/℃; Operating Temperature Range: -55℃~+155℃
R34 = 0402WGF9102TCE: Type:Thick Film Resistors Resistance:91kΩ Tolerance:±1% Tolerance:±1% Power(Watts): Overload Voltage (Max): Temperature Coefficient:±100ppm/℃ Temperature Coefficient:±100ppm/℃ Operating Temperature Range:-55℃~+155℃ Operating Temperature Range:-55℃~+155℃; LCSC Part Name: 91kΩ ±1% 62.5mW 厚膜电阻; Supplier Part: C4147; Manufacturer: UNI-ROYAL(厚声); Supplier Footprint: 0402; JLCPCB Part Class: Extended Part; Datasheet: https://atta.szlcsc.com/upload/public/pdf/source/20200306/C422600_1E6D84923E4A46A82E41ADD87F860B5C.pdf; Supplier: LCSC; Type: Thick Film Resistors; Tolerance: ±1%; Temperature Coefficient: ±100ppm/℃; Operating Temperature Range: -55℃~+155℃
R39 = 0402WGF2001TCE: Type:Thick Film Resistors Resistance:2kΩ Tolerance:±1% Tolerance:±1% Power(Watts): Overload Voltage (Max): Temperature Coefficient:±100ppm/℃ Temperature Coefficient:±100ppm/℃ Operating Temperature Range:-55℃~+155℃ Operating Temperature Range:-55℃~+155℃; LCSC Part Name: 2kΩ ±1% 62.5mW 厚膜电阻; Supplier Part: C4109; Manufacturer: UNI-ROYAL(厚声); Supplier Footprint: 0402; JLCPCB Part Class: Basic Part; Datasheet: https://atta.szlcsc.com/upload/public/pdf/source/20200306/C422600_1E6D84923E4A46A82E41ADD87F860B5C.pdf; Supplier: LCSC; Type: Thick Film Resistors; Tolerance: ±1%; Temperature Coefficient: ±100ppm/℃; Operating Temperature Range: -55℃~+155℃
SW10 = SK12D07VG5: Circuit:SPDT Actuator Style:- Pin Style:PCPin Switch Length:8.7mm Switch Width:4.4mm Switch Height:4.7mm Mounting Style:侧插 Actuator Color:- Current Rating (DC):500mA Voltage Rating (DC):50V Current Rating (AC):- Voltage Rating (AC):- Mechanical Life:5千次 O; LCSC Part Name: 两档位卧式拨动开关,柄长5MM; Supplier Part: C431548; Manufacturer: SHOU HAN(首韩); Supplier Footprint: 插件; JLCPCB Part Class: Extended Part; Datasheet: https://atta.szlcsc.com/upload/public/pdf/source/20190925/C431548_D6571AEBDE139FDB1E6F8A4B1513A630.pdf; Supplier: LCSC; Circuit: SPDT; Pin Style: PCPin; Switch Length: 8.7mm; Switch Width: 4.4mm; Switch Height: 4.7mm; Mounting Style: 侧插; Current Rating (DC): 500mA; Voltage Rating (DC): 50V; Mechanical Life: 5千次; Operating Temperature: -10℃~+50℃
U14 = TPS63805YFFR: Function:Buck-boost type Output Type:Adjustable Input Voltage:1.3V~5.5V Input Voltage:1.3V~5.5V Output Voltage:1.8V~5.2V Output Voltage:1.8V~5.2V Output Current (Max):2A Switching Frequency:1.4MHz；1.6MHz；2.1MHz Operating Temperature:-40℃~+125℃@(TJ) Operat; Supplier Part: C2879615; Manufacturer: TI(德州仪器); Supplier Footprint: DSBGA-15; JLCPCB Part Class: Extended Part; Datasheet: https://www.ti.com/cn/lit/gpn/tps63806; Supplier: LCSC; Function: Buck-boost type; Output Type: Adjustable; Input Voltage: 1.3V~5.5V; Output Voltage: 1.8V~5.2V; Output Current (Max): 2A; Switching Frequency: 1.4MHz；1.6MHz；2.1MHz; Operating Temperature: -40℃~+125℃@(TJ); Synchronous Rectification: Yes; Number of Outputs: 1; Topology: Step-down-Boost; Switch tube (built-in/external): 内置
U15 = BQ24040DSQR: Supplier Part: C81080; Manufacturer: TI(德州仪器); Supplier Footprint: WSON-10-EP(2x2); JLCPCB Part Class: Extended Part; Datasheet: https://www.ti.com/cn/lit/gpn/bq24040; Supplier: LCSC
U37 = 78L05_C347258: Output Type:Fixed Voltage - Supply:30V Output Voltage:5V Output Voltage:5V Output Current:100mA Power Supply Rejection Ratio (PSRR):49dB@(120Hz) Voltage Dropout:1.7V standby current:2mA Noise:40uV Features:Over Temperature Protection；Short Circuit Protect; LCSC Part Name: 输入30V 输出5V 100mA; Supplier Part: C347258; Manufacturer: UMW(友台半导体); Supplier Footprint: SOT-89-3; JLCPCB Part Class: Extended Part; Datasheet: https://item.szlcsc.com/datasheet/78L05/323918.html; Supplier: LCSC; Output Type: Fixed; Voltage - Supply: 30V; Output Voltage: 5V; Output Current: 100mA; Power Supply Rejection Ratio (PSRR): 49dB@(120Hz); Voltage Dropout: 1.7V; standby current: 2mA; Noise: 40uV; Features: Over Temperature Protection；Short Circuit Protection; Operating Temperature: -20℃~+120℃@(Tj); Output Configuration: Positive; Number of Outputs: 1

## Nets
+3V3: C67.2 C85.2 C86.2 C87.2 C88.2 C89.2 CN2.4 D15.1(K) R214.2 U1.1(VBAT) U1.9(VDDA) U1.24(VDD_1) U1.36(VDD_2) U1.48(VDD_3) U3.1(+) U37.1(OUT)
+5V: C1.1 C2.1 C3.1 C4.1 C5.1 C6.1 C7.1 C8.1 C9.1 C39.2 C66.2 C71.1 C72.1 C73.1 C74.1 C75.1 C76.1 C77.1 C78.1 C79.1 C80.1 C81.1 C82.1 C83.1 LED1.4(VDD) LED2.4(VDD) LED3.4(VDD) LED4.4(VDD) LED5.4(VDD) LED6.4(VDD) LED7.4(VDD) LED8.4(VDD) LED9.4(VDD) LED10.4(VDD) LED11.4(VDD) LED12.4(VDD) LED13.4(VDD) LED14.4(VDD) LED15.4(VDD) LED16.4(VDD) LED17.4(VDD) LED18.4(VDD) LED19.4(VDD) LED20.4(VDD) LED21.4(VDD) LED22.4(VDD) R32.2 U14.E2(VOUT) U14.E3(VOUT) U37.3(IN)
GND: C1.2 C2.2 C3.2 C4.2 C5.2 C6.2 C7.2 C8.2 C9.2 C38.1 C39.1 C40.1 C41.1 C65.1 C66.1 C67.1 C68.1 C69.1 C71.2 C72.2 C73.2 C74.2 C75.2 C76.2 C77.2 C78.2 C79.2 C80.2 C81.2 C82.2 C83.2 C85.1 C86.1 C87.1 C88.1 C89.1 C90.1 C91.1 CN1.1 CN1.3 CN1.4 CN2.1 CN2.5 CN2.6 H1.1 LED1.2(GND) LED2.2(GND) LED3.2(GND) LED4.2(GND) LED5.2(GND) LED6.2(GND) LED7.2(GND) LED8.2(GND) LED9.2(GND) LED10.2(GND) LED11.2(GND) LED12.2(GND) LED13.2(GND) LED14.2(GND) LED15.2(GND) LED16.2(GND) LED17.2(GND) LED18.2(GND) LED19.2(GND) LED20.2(GND) LED21.2(GND) LED22.2(GND) Q1.2(E) R5.2 R34.1 R36.1 R38.1 R39.2 R51.2 R52.1 R53.1 R55.1 SW9.2 SW10.4 SW10.5 SW11.1(A1) SW11.2(A2) U1.8(VSSA) U1.23(VSS_1) U1.35(VSS_2) U1.47(VSS_3) U3.3(NC) U14.B1(MODE) U14.C1(AGND) U14.C2(GND) U14.C3(GND) U15.3(VSS) U15.7(ISET2) U15.11(EP) U36.2(GND) U37.2(GND) USB5.1(GND) USB5.12(GND) USB5.13(SHELL) USB5.14(SHELL)
VBAT+: C41.2 CN1.2 R35.1 R37.2 SW10.3 U15.10(OUT)
VBUS: C40.2 U15.1(IN) U36.5(VBUS) USB5.2(VBUS) USB5.11(VBUS)
VCC: C38.2 R30.2 R54.2 SW10.2 U14.A1(EN) U14.A2(VIN) U14.A3(VIN)
BOOT0: R53.2 U1.44(BOOT0)
BUZZ_PWM: R4.1 U1.16(PA6)
LED_DI: LED1.3(DI) U1.29(PA8)
MCU_USB_DM: U1.32(PA11) U36.3(I/O2)
MCU_USB_DP: R214.1 U1.33(PA12) U36.1(I/O1)
MCU_VMEAS: C65.2 R54.1 R55.2 U1.14(PA4)
NRST: C90.2 SW9.3 U1.7(NRST)
SWC: CN2.3 R213.1
SWCLK: R213.2 U1.37(PA14)
SWD: CN2.2 R212.2
SWDIO: R212.1 U1.34(PA13)
$1N9010: R51.1 USB5.10(CC2)
$1N9015: R52.2 USB5.4(CC1)
$1N9047: U36.6(I/O1) USB5.6(DP1) USB5.8(DP2)
$1N9066: U36.4(I/O2) USB5.5(DN2) USB5.7(DN1)
$1N9745: Q1.1(B) R4.2 R5.1
$1N9747: D15.2(A) Q1.3(C) U3.2(-)
$1N11688: C68.2 U1.5(PD0-OSC_IN) X1.2(OSC2)
$1N11697: C69.2 U1.6(PD1-OSC_OUT) X1.1(OSC1)
$1N12308: C91.2 H1.2 U1.10(PA0-WKUP)
$1N12558: SW11.3(B2) U1.19(PB1)
$1N12563: SW11.4(B1) U1.18(PB0)
$2N422: LED1.1(DO) LED2.3(DI)
$2N542: LED2.1(DO) LED3.3(DI)
$2N662: LED3.1(DO) LED4.3(DI)
$2N782: LED4.1(DO) LED5.3(DI)
$2N902: LED5.1(DO) LED6.3(DI)
$2N1022: LED6.1(DO) LED7.3(DI)
$2N1142: LED7.1(DO) LED8.3(DI)
$2N1262: LED8.1(DO) LED9.3(DI)
$2N2829: LED9.1(DO) LED10.3(DI)
$2N2832: LED10.1(DO) LED11.3(DI)
$2N2835: LED11.1(DO) LED12.3(DI)
$2N2838: LED12.1(DO) LED13.3(DI)
$2N2841: LED13.1(DO) LED14.3(DI)
$2N2844: LED14.1(DO) LED15.3(DI)
$2N2847: LED15.1(DO) LED16.3(DI)
$2N2850: LED16.1(DO) LED17.3(DI)
$2N2853: LED17.1(DO) LED18.3(DI)
$2N4589: LED18.1(DO) LED19.3(DI)
$2N4593: LED19.1(DO) LED20.3(DI)
$2N4596: LED20.1(DO) LED21.3(DI)
$2N4599: LED21.1(DO) LED22.3(DI)
$3N1341: R38.2 U15.2(ISET)
$3N1343: R36.2 U15.9(TS)
$3N1344: R39.1 U15.4(PRETERM)
$3N1345: D13.2(A) R35.2
$3N1346: D14.2(K) U15.8(CHG#)
$3N1355: L7.2 U14.D2(L2) U14.D3(L2)
$3N1356: L7.1 U14.B2(L1) U14.B3(L1)
$3N1361: R32.1 R34.2 U14.D1(FB)
$3N1362: R30.1 U14.E1(PG)
$3N1363: D13.1(K) U15.5(PG#)
$3N1708: D14.1(A) R37.1

Not connected (* = marked no-connect by the designer): LED22 1(DO)*; SW9 1* 4*; SW10 1*; U1 2(PC13-TAMPER-RTC) 3(PC14-OSC32_IN) 4(PC15-OSC32_OUT) 11(PA1) 12(PA2) 13(PA3) 15(PA5) 17(PA7) 20(PB2) 21(PB10) 22(PB11) 25(PB12) 26(PB13) 27(PB14) 28(PB15) 30(PA9) 31(PA10) 38(PA15) 39(PB3) 40(PB4) 41(PB5) 42(PB6) 43(PB7) 45(PB8) 46(PB9); U15 6(NC)*; USB5 3(SBU2)* 9(SBU1)*

## Notes on the sheets
sheet 1
- REQUIRED:
  RGB LEDS
  MCU
  USB-C CHARGE CIRCUIT
  BATTERY CONNECTOR
  ON/OFF SWITCH
  MODE SELECT SWITCHES
- OPTIONAL:
  ACCELEROMETER?
  VIBRATION MOTOR?
  SPEAKER?
- USB-C
- To be compliant with the USB 2.0 full-speed electrical specification, the USBDP (D+) pin
  must be pulled up with a 1.5 kΩ resistor to a 3.0 to 3.6 V voltage range
- NEEDS HSE CRYSTAL
- SWD CONNECTOR
- CL = 2*(20 pF−10 pF)
   = 20 pF
- MAIN BUTTON
- MODE-SELECT SWITCHES
- BIEP BIEP
  MOTHERFUCKER
- Measure VBAT or VBUS going into the 3.3V regulator
- BUZZER
sheet 3
- JST PH 2 pin batterij connector
- ISET: Programs the Fast-charge current setting.
  External resistor from ISET to VSS defines fast charge current value.
  Range is 10.8k (50mA) to 540Ω (1000mA).
- R680 = +/- 1000mA max charging current
- LiPo charging circuit
- 5V Power supply
- 3V3 Power supply
